# EasyEDA Pro project Tb66_and_DRV88_Teensy_LFR_PCB.epro, schematic Schematic2
Board Name: DRV88 bot; Create Date: 2025-07-18; Page Name: P1; Project Name: Professional Line Follower Robot; Schematic Name: Schematic2; Update Date: 2025-07-19; Company: EasyEDA.com; Page Size: A4; Version: V1.0
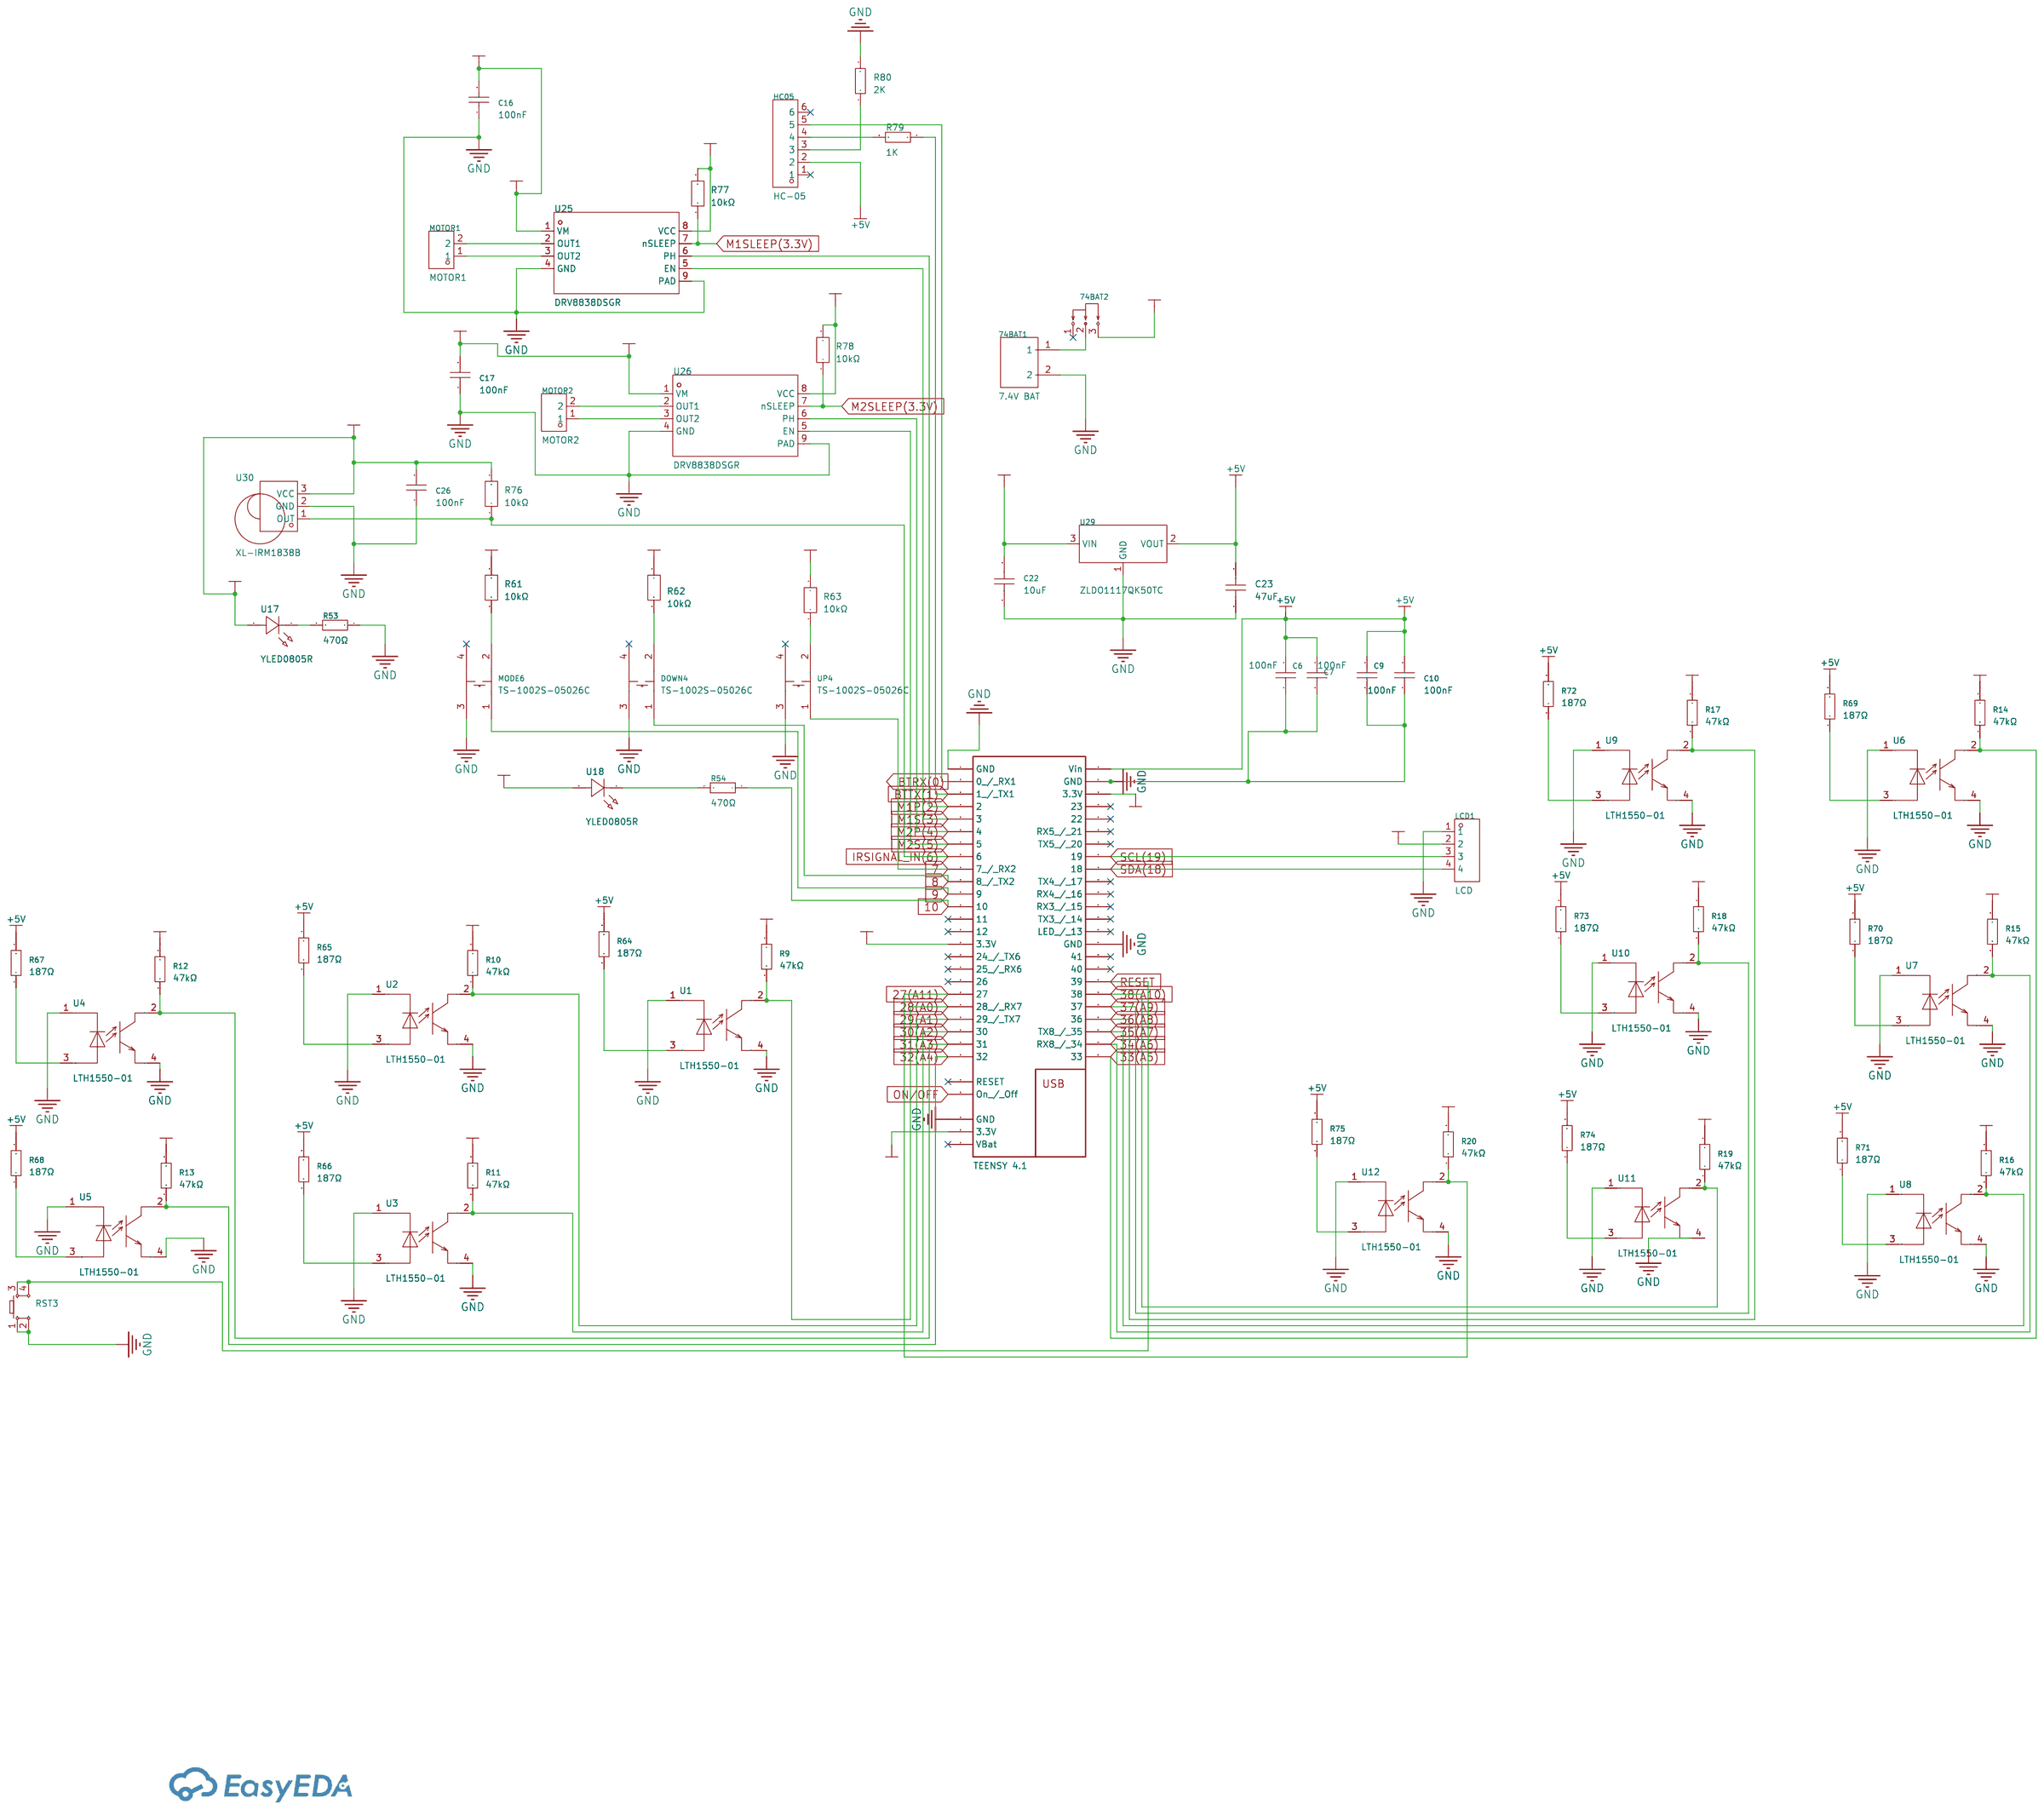
[diagram p0: schematic sheet]

## Parts
74BAT1  7.4V BAT  [CONN-TH_WJ126V-5.0-2P]
74BAT2  SS12D10G4 071  [SW-TH_SHOU-HAN_SS12D10G4]
C6  100nF  [C1206]
C7  100nF  [C1206]
C9  100nF  [C1206]
C10  100nF  [C1206]
C16  100nF  [C1206]
C17  100nF  [C1206]
C22  10uF  [C0805]
C23  47uF  [C1206]
C26  100nF  [C1206]
DOWN4  TS-1002S-05026C  [KEY-SMD_4P-L6.0-W6.0-P4.50-LS9.0]
HC05  HC-05  [HDR-TH_6P-P2.54-V-F]
LCD1  LCD  [HDR-TH_4P-P2.54-V-F]
MODE6  TS-1002S-05026C  [KEY-SMD_4P-L6.0-W6.0-P4.50-LS9.0]
MOTOR1  MOTOR1  [HDR-TH_2P-P2.54-V-M]
MOTOR2  MOTOR2  [HDR-TH_2P-P2.54-V-M]
R9  47kΩ  [R0805]
R10  47kΩ  [R0805]
R11  47kΩ  [R0805]
R12  47kΩ  [R0805]
R13  47kΩ  [R0805]
R14  47kΩ  [R0805]
R15  47kΩ  [R0805]
R16  47kΩ  [R0805]
R17  47kΩ  [R0805]
R18  47kΩ  [R0805]
R19  47kΩ  [R0805]
R20  47kΩ  [R0805]
R53  470Ω  [R0805]
R54  470Ω  [R0805]
R61  10kΩ  [R0805]
R62  10kΩ  [R0805]
R63  10kΩ  [R0805]
R64  187Ω  [R0805]
R65  187Ω  [R0805]
R66  187Ω  [R0805]
R67  187Ω  [R0805]
R68  187Ω  [R0805]
R69  187Ω  [R0805]
R70  187Ω  [R0805]
R71  187Ω  [R0805]
R72  187Ω  [R0805]
R73  187Ω  [R0805]
R74  187Ω  [R0805]
R75  187Ω  [R0805]
R76  10kΩ  [R0805]
R77  10kΩ  [R0805]
R78  10kΩ  [R0805]
R79  1K  [R0603]
R80  2K  [R0603]
RST3  -  [SW-SMD_4P-L6.0-W6.0-P4.50-LS9.0-2]
U1  LTH1550-01  [OPTO-TH_4P-L8.7-W4.5-P4.10_LTH1550-01]
U2  LTH1550-01  [OPTO-TH_4P-L8.7-W4.5-P4.10_LTH1550-01]
U3  LTH1550-01  [OPTO-TH_4P-L8.7-W4.5-P4.10_LTH1550-01]
U4  LTH1550-01  [OPTO-TH_4P-L8.7-W4.5-P4.10_LTH1550-01]
U5  LTH1550-01  [OPTO-TH_4P-L8.7-W4.5-P4.10_LTH1550-01]
U6  LTH1550-01  [OPTO-TH_4P-L8.7-W4.5-P4.10_LTH1550-01]
U7  LTH1550-01  [OPTO-TH_4P-L8.7-W4.5-P4.10_LTH1550-01]
U8  LTH1550-01  [OPTO-TH_4P-L8.7-W4.5-P4.10_LTH1550-01]
U9  LTH1550-01  [OPTO-TH_4P-L8.7-W4.5-P4.10_LTH1550-01]
U10  LTH1550-01  [OPTO-TH_4P-L8.7-W4.5-P4.10_LTH1550-01]
U11  LTH1550-01  [OPTO-TH_4P-L8.7-W4.5-P4.10_LTH1550-01]
U12  LTH1550-01  [OPTO-TH_4P-L8.7-W4.5-P4.10_LTH1550-01]
U17  YLED0805R  [LED0805-RD]
U18  YLED0805R  [LED0805-RD]
U25  DRV8838DSGR  [WSON-8_L2.0-W2.0-P0.50-TL-EP]
U26  DRV8838DSGR  [WSON-8_L2.0-W2.0-P0.50-TL-EP]
U29  ZLDO1117QK50TC  [TO-252-3_L6.6-W6.1-P4.57-LS9.9-BR-CW]
U30  XL-IRM1838B  [OPTO-TH_3P-L7.0-W5.6-P2.54-L]
U31  TEENSY 4.1  [TEENSY41 solved]
UP4  TS-1002S-05026C  [KEY-SMD_4P-L6.0-W6.0-P4.50-LS9.0]

## Library data of the parts
74BAT1 = WJ126V-5.0-2P: Structure:1x2P Pitch:5mm Color:Green Mounting Style:Straight Current Rating (Max):18A Voltage Rating (Max):250V Number of Pins:2P Number of Rows:1 Wire Gauge - AWG:14~26 Wire Gauge - AWG:14~26 Wire Gauge - mm2:2.5 Wire Gauge - mm2:2.5 Number of PINs Per R; LCSC Part Name: 5mm 1x2P 排数:1 每排P数:2 直插; Supplier Part: C8404; Manufacturer: KANGNEX(康奈克斯电气); Supplier Footprint: 插件,P=5mm; JLCPCB Part Class: Extended Part; Datasheet: https://atta.szlcsc.com/upload/public/pdf/source/20191225/C8404_8F52D87DF851D149A4DEA9BD9FA83F9A.pdf; Supplier: LCSC; Structure: 1x2P; Pitch: 5mm; Color: Green; Mounting Style: Straight; Current Rating (Max): 18A; Voltage Rating (Max): 250V; Number of Pins: 2P; Number of Rows: 1; Wire Gauge - AWG: 14~26; Wire Gauge - mm2: 2.5; Number of PINs Per Row: 2; Operating Temperature Range: -40℃~+105℃
74BAT2 = SS12D10G4 071: Circuit:SPDT Actuator Style:- Pin Style:PCPin Switch Length:12.7mm Switch Width:6.7mm Switch Height:6.4mm Mounting Style:Straight Actuator Color:- Current Rating (DC):2A Voltage Rating (DC):125V Current Rating (AC):- Voltage Rating (AC):- Mechanical Life:; Supplier Part: C2887259; Manufacturer: SHOU HAN(首韩); Supplier Footprint: 插件; JLCPCB Part Class: Extended Part; Datasheet: https://atta.szlcsc.com/upload/public/pdf/source/20210820/80D1704BBF3FCEE0435FCAA54C61E0A3.pdf; Supplier: LCSC; Circuit: SPDT; Pin Style: PCPin; Switch Length: 12.7mm; Switch Width: 6.7mm; Switch Height: 6.4mm; Mounting Style: Straight; Current Rating (DC): 2A; Voltage Rating (DC): 125V; Mechanical Life: 3千次; Operating Temperature: -16℃~+60℃
C6 C7 C9 C10 C16 C17 C26 = CL31B104KBCNNNC: Capacitance: Tolerance:±10% Tolerance:±10% Voltage Rated: Temperature Coefficient:; LCSC Part Name: 100nF ±10% 50V; Supplier Part: C24497; Manufacturer: SAMSUNG(三星); Supplier Footprint: 1206; JLCPCB Part Class: Basic Part; Datasheet: https://atta.szlcsc.com/upload/public/pdf/source/20160218/1457707763339.pdf; Supplier: LCSC; Tolerance: ±10%
C22 = GRM21BR61E106KA73L: Capacitance: Tolerance:±10% Tolerance:±10% Voltage Rated: Temperature Coefficient:; LCSC Part Name: 10uF ±10% 25V; Supplier Part: C84416; Manufacturer: muRata(村田); Supplier Footprint: 0805; JLCPCB Part Class: Extended Part; Datasheet: https://atta.szlcsc.com/upload/public/pdf/source/20161024/1477288637384.pdf; Supplier: LCSC; Tolerance: ±10%
C23 = GRM31CR61E476ME44L: Capacitance: Tolerance:±20% Tolerance:±20% Voltage Rated: Temperature Coefficient:; LCSC Part Name: 47uF ±20% 25V; Supplier Part: C403725; Manufacturer: muRata(村田); Supplier Footprint: 1206; JLCPCB Part Class: Extended Part; Datasheet: https://atta.szlcsc.com/upload/public/pdf/source/20191025/C403725_B8A8CD2FFA1F57E6FDF268BD106459D5.pdf; Supplier: LCSC; Tolerance: ±20%
DOWN4 MODE6 UP4 = TS-1002S-05026C: Circuit:SPST Actuator Style:Round Button Mounting Style:Brick nogging Switch Length:6mm Switch Width:6mm Switch Height:5mm Contact Current:50mA Voltage Rating (DC):12V With Lamp:- Mechanical Life:-; LCSC Part Name: 6*6*5mm 立贴 轻触开关; Supplier Part: C455110; Manufacturer: XUNPU(讯普); Supplier Footprint: SMD,6x6mm; JLCPCB Part Class: Extended Part; Datasheet: https://atta.szlcsc.com/upload/public/pdf/source/20191118/C455126_F61E8FA1ED640FB1CE0B30B55DEB62E3.pdf; Supplier: LCSC; Circuit: SPST; Actuator Style: Round Button; Mounting Style: Brick nogging; Switch Length: 6mm; Switch Width: 6mm; Switch Height: 5mm; Contact Current: 50mA; Voltage Rating (DC): 12V
HC05 = 2.54-1*6P母: Holes Structure:1x6P Pitch:2.54mm Row Spacing:- Mounting Type:Straight Number of Rows:Plugin Number of Holes:6P Insulation Height:- Contact Material:- Contact Plating:-; LCSC Part Name: 间距:2.54mm 1x6P 直插; Supplier Part: C40877; Manufacturer: BOOMELE(博穆精密); Supplier Footprint: 插件,P=2.54mm; JLCPCB Part Class: Extended Part; Datasheet: https://atta.szlcsc.com/upload/public/pdf/source/20210301/C2718488_F4427B881E42CAA8DDB0B1C12B3A522C.pdf; Supplier: LCSC; Holes Structure: 1x6P; Pitch: 2.54mm; Mounting Type: Straight; Number of Rows: Plugin; Number of Holes: 6P
LCD1 = 2.54-1*4P母: Holes Structure:1x4P Pitch:2.54mm Row Spacing:- Circular Hole / Square Hole:Square Holes Mounting Type:Straight Number of Rows:Plugin Number of Holes:4P Current Rating (Max):3A Voltage Rating (Max):- Holes Direction:Top Insulation Height:- Contact Materia; LCSC Part Name: 间距:2.54mm 1x4P 直插; Supplier Part: C2718488; Manufacturer: BOOMELE(博穆精密); Supplier Footprint: 插件,P=2.54mm; JLCPCB Part Class: Extended Part; Datasheet: https://atta.szlcsc.com/upload/public/pdf/source/20210301/C2718488_F4427B881E42CAA8DDB0B1C12B3A522C.pdf; Supplier: LCSC; Holes Structure: 1x4P; Pitch: 2.54mm; Circular Hole / Square Hole: Square Holes; Mounting Type: Straight; Number of Rows: Plugin; Number of Holes: 4P; Current Rating (Max): 3A; Holes Direction: Top; Contact Material: bronze; Operating Temperature Range: -40℃~+105℃
MOTOR1 MOTOR2 = PZ254V-11-02P: Pin Structure:1x2P Pitch:2.54mm Row Spacing:- Circluar Pins/Square Pins:Square Pins Mounting Type:Straight Number of Rows:Plugin Number of Pins:2P Current Rating (Max):- Voltage Rating (Max):- Length of Mating Pin:6mm Insulation Height:2.5mm Length of End; LCSC Part Name: 间距:2.54mm 1x2P 直插 方针; Supplier Part: C492401; Manufacturer: XFCN(兴飞); Supplier Footprint: 插件,P=2.54mm; JLCPCB Part Class: Extended Part; Datasheet: https://atta.szlcsc.com/upload/public/pdf/source/20200309/C492401_A812433581A9B211A7FFA413ADDFF0E5.pdf; Supplier: LCSC; Pin Structure: 1x2P; Pitch: 2.54mm; Circluar Pins/Square Pins: Square Pins; Mounting Type: Straight; Number of Rows: Plugin; Number of Pins: 2P; Length of Mating Pin: 6mm; Insulation Height: 2.5mm; Length of End Connection Pin: 3mm; Operating Temperature Range: -40℃~+105℃; Color: Black
R9-R20 = 0805W8F4702T5E: Type:Thick Film Resistors Resistance:47kΩ Tolerance:±1% Tolerance:±1% Power(Watts): Overload Voltage (Max): Temperature Coefficient:±100ppm/℃ Temperature Coefficient:±100ppm/℃ Operating Temperature Range:-55℃~+155℃ Operating Temperature Range:-55℃~+155℃; LCSC Part Name: 47kΩ ±1% 125mW 厚膜电阻; Supplier Part: C17713; Manufacturer: UNI-ROYAL(厚声); Supplier Footprint: 0805; JLCPCB Part Class: Basic Part; Datasheet: https://atta.szlcsc.com/upload/public/pdf/source/20200306/C422600_1E6D84923E4A46A82E41ADD87F860B5C.pdf; Supplier: LCSC; Type: Thick Film Resistors; Tolerance: ±1%; Temperature Coefficient: ±100ppm/℃; Operating Temperature Range: -55℃~+155℃
R53 R54 = 0805W8F4700T5E: Type:Thick Film Resistors Resistance: Tolerance:±1% Tolerance:±1% Power(Watts): Overload Voltage (Max): Temperature Coefficient:±100ppm/℃ Temperature Coefficient:±100ppm/℃ Operating Temperature Range:-55℃~+155℃ Operating Temperature Range:-55℃~+155℃; LCSC Part Name: 470Ω ±1% 125mW 厚膜电阻; Supplier Part: C17710; Manufacturer: UNI-ROYAL(厚声); Supplier Footprint: 0805; JLCPCB Part Class: Basic Part; Datasheet: https://atta.szlcsc.com/upload/public/pdf/source/20200306/C422600_1E6D84923E4A46A82E41ADD87F860B5C.pdf; Supplier: LCSC; Type: Thick Film Resistors; Tolerance: ±1%; Temperature Coefficient: ±100ppm/℃; Operating Temperature Range: -55℃~+155℃
R61-R63 R76-R78 = FRC0805J103TS: Type:Thick Film Resistors Resistance:10kΩ Tolerance:±5% Tolerance:±5% Power(Watts): Overload Voltage (Max): Temperature Coefficient:±100ppm/℃ Temperature Coefficient:±100ppm/℃ Operating Temperature Range:-55℃~+155℃ Operating Temperature Range:-55℃~+155℃; LCSC Part Name: 10kΩ ±5% 125mW 厚膜电阻; Supplier Part: C2930231; Manufacturer: FOJAN(富捷); Supplier Footprint: 0805; JLCPCB Part Class: Extended Part; Datasheet: https://atta.szlcsc.com/upload/public/pdf/source/20211221/925EC7D7225764EE0046F22065062C87.pdf; Supplier: LCSC; Type: Thick Film Resistors; Tolerance: ±5%; Temperature Coefficient: ±100ppm/℃; Operating Temperature Range: -55℃~+155℃
R64-R75 = RTT051870FTP: Type:Thick Film Resistors Resistance: Tolerance:±1% Tolerance:±1% Power(Watts): Overload Voltage (Max): Temperature Coefficient:±100ppm/℃ Temperature Coefficient:±100ppm/℃ Operating Temperature Range:-55℃~+155℃ Operating Temperature Range:-55℃~+155℃; LCSC Part Name: 厚膜电阻 187Ω ±1% 125mW; Supplier Part: C104054; Manufacturer: RALEC(旺诠); Supplier Footprint: 0805; JLCPCB Part Class: Extended Part; Datasheet: https://atta.szlcsc.com/upload/public/pdf/source/20191219/C158410_884373A5B7E1BC76BF57BC45A946C093.pdf; Supplier: LCSC; Type: Thick Film Resistors; Tolerance: ±1%; Temperature Coefficient: ±100ppm/℃; Operating Temperature Range: -55℃~+155℃
R79 R80 = Res_0603: Supplier Footprint: 0603
RST3 = Key_SMD_6x6x6.5: Supplier Footprint: SMD
U1-U12 = LTH1550-01: Supplier Part: C3040662; Supplier Footprint: DIP-4; JLCPCB Part Class: Extended Part; Supplier: LCSC
U17 U18 = YLED0805R: Emitted Color:Red Forward Voltage (VF):1.8V~2.4V Forward Voltage (VF):1.8V~2.4V Power Dissipation:60mW Forward Current:20mA Dominant Wavelength:615nm~630nm Dominant Wavelength:615nm~630nm Peak Wavelength:645nm Diode Configuration:- Lens Color:- Color Temp; Supplier Part: C19171391; Manufacturer: YONGYUTAI(永裕泰); Supplier Footprint: 0805; JLCPCB Part Class: Extended Part; Datasheet: https://atta.szlcsc.com/upload/public/pdf/source/20231027/AB486D22E6D71BC59190C48A798367E6.pdf; Supplier: LCSC; Emitted Color: Red; Forward Voltage (VF): 1.8V~2.4V; Power Dissipation: 60mW; Forward Current: 20mA; Dominant Wavelength: 615nm~630nm; Peak Wavelength: 645nm; Operating Temperature: -40℃~+85℃
U25 U26 = DRV8838DSGR: LCSC Part Name: 1.8A 有刷直流电机驱动芯片 7V; Supplier Part: C86667; Manufacturer: TI(德州仪器); Supplier Footprint: WSON-8-EP(2x2); JLCPCB Part Class: Extended Part; Datasheet: https://www.ti.com/cn/lit/gpn/drv8838; Supplier: LCSC
U29 = ZLDO1117QK50TC: Supplier Part: C6016205; Manufacturer: DIODES(美台); Supplier Footprint: TO-252; JLCPCB Part Class: Extended Part; Datasheet: https://atta.szlcsc.com/upload/public/pdf/source/20200515/C526778_6D474893D29915DF671E16CD14EB3DFD.pdf; Supplier: LCSC
U30 = XL-IRM1838B: Supplier Part: C19725373; Manufacturer: XINGLIGHT(成兴光); Supplier Footprint: SIP-3; JLCPCB Part Class: Extended Part; Datasheet: https://atta.szlcsc.com/upload/public/pdf/source/20240218/5B94567FA257E49E0A83EC50DE771372.pdf; Supplier: LCSC
U31 = TEENSY 4.1

## Nets
+3.3V: C26.2 LCD1.2 R9.1 R10.2 R11.2 R12.1 R13.2 R14.2 R15.1 R16.2 R17.2 R18.1 R19.2 R20.2 R61.2 R62.1 R63.2 R76.2 R77.2 R78.2 U17.2(A) U18.2(A) U25.8(VCC) U26.8(VCC) U30.3(VCC) U31.15(3.3V) U31.46(3.3V) U31.52(3.3V)
+5V: C6.2 C7.2 C9.2 C10.2 C23.2 HC05.2 R64.2 R65.2 R66.2 R67.2 R68.2 R69.2 R70.2 R71.2 R72.2 R73.2 R74.2 R75.2 U29.2(VOUT) U31.48(Vin)
+7.4V: 74BAT2.3 C16.2 C17.2 C22.2 U25.1(VM) U26.1(VM) U29.3(VIN)
GND: 74BAT1.2 C6.1 C7.1 C9.1 C10.1 C16.1 C17.1 C22.1 C23.1 C26.1 DOWN4.3 LCD1.1 MODE6.3 R53.1 R80.2 RST3.1 RST3.2 U1.1(A) U1.4(EM) U2.1(A) U2.4(EM) U3.1(A) U3.4(EM) U4.1(A) U4.4(EM) U5.1(A) U5.4(EM) U6.1(A) U6.4(EM) U7.1(A) U7.4(EM) U8.1(A) U8.4(EM) U9.1(A) U9.4(EM) U10.1(A) U10.4(EM) U11.1(A) U11.4(EM) U12.1(A) U12.4(EM) U25.4(GND) U25.9(PAD) U26.4(GND) U26.9(PAD) U29.1(GND) U30.2(GND) U31.1(GND) U31.34(GND) U31.47(GND) U31.51(GND) UP4.3
7: U31.9(7 / RX2) UP4.1
8: DOWN4.1 U31.10(8 / TX2)
9: MODE6.1 U31.11(9)
10: R54.1 U31.12(10)
27(A11): R20.1 U12.2(C) U31.19(27)
28(A0): R9.2 U1.2(C) U31.20(28 / RX7)
29(A1): R10.1 U2.2(C) U31.21(29 / TX7)
30(A2): R11.1 U3.2(C) U31.22(30)
31(A3): R12.2 U4.2(C) U31.23(31)
32(A4): R13.1 U5.2(C) U31.24(32)
33(A5): R14.1 U6.2(C) U31.25(33)
34(A6): R15.2 U7.2(C) U31.26(RX8 / 34)
35(A7): R16.1 U8.2(C) U31.27(TX8 / 35)
36(A8): R17.1 U9.2(C) U31.28(36)
37(A9): R18.2 U10.2(C) U31.29(37)
38(A10): R19.1 U11.2(C) U31.30(38)
BTRX(0): HC05.5 U31.2(0 / RX1)
BTTX(1): R79.1 U31.3(1 / TX1)
IRSIGNAL_IN(6): R76.1 U30.1(OUT) U31.8(6)
M1P(2): U25.6(PH) U31.4(2)
M1S(3): U25.5(EN) U31.5(3)
M1SLEEP(3.3V): R77.1 U25.7(nSLEEP)
M2P(4): U26.6(PH) U31.6(4)
M2S(5): U26.5(EN) U31.7(5)
M2SLEEP(3.3V): R78.1 U26.7(nSLEEP)
ON/OFF: U31.49(On / Off)
RESET: RST3.3 RST3.4 U31.31(39)
SCL(19): LCD1.3 U31.41(19)
SDA(18): LCD1.4 U31.40(18)
$1N12804: R68.1 U5.3(COL)
$1N12805: R67.1 U4.3(COL)
$1N12816: R65.1 U2.3(COL)
$1N12817: R66.1 U3.3(COL)
$1N12824: R64.1 U1.3(COL)
$1N12829: HC05.4 R79.2
$1N12830: HC05.3 R80.1
$1N12842: R63.1 UP4.2
$1N12844: DOWN4.2 R62.2
$1N12845: MODE6.2 R61.1
$1N12852: R54.2 U18.1(K)
$1N12862: R73.1 U10.3(COL)
$1N12863: R74.1 U11.3(COL)
$1N12864: R75.1 U12.3(COL)
$1N12875: R71.1 U8.3(COL)
$1N12876: R72.1 U9.3(COL)
$1N12883: R69.1 U6.3(COL)
$1N12886: 74BAT1.1 74BAT2.2
$1N12898: R53.2 U17.1(K)
$1N12918: R70.1 U7.3(COL)
$1N15829: MOTOR1.2 U25.2(OUT1)
$1N15830: MOTOR1.1 U25.3(OUT2)
$1N16024: MOTOR2.2 U26.2(OUT1)
$1N16025: MOTOR2.1 U26.3(OUT2)

Not connected (* = marked no-connect by the designer): 74BAT2 1*; DOWN4 4*; HC05 1* 6*; MODE6 4*; U31 13(11)* 14(12)* 16(24 / TX6)* 17(25 / RX6)* 18(26)* 32(40)* 33(41)* 35(LED / 13)* 36(TX3 / 14)* 37(RX3 / 15)* 38(RX4 / 16)* 39(TX4 / 17)* 42(TX5 / 20)* 43(RX5 / 21)* 44(22)* 45(23)* 50(RESET)* 53(VBat)*; UP4 4*
